# Altium schematic sheet USB.SchDoc
size 420 x 297 mm; SheetNumber: 12; SheetTotal: 21
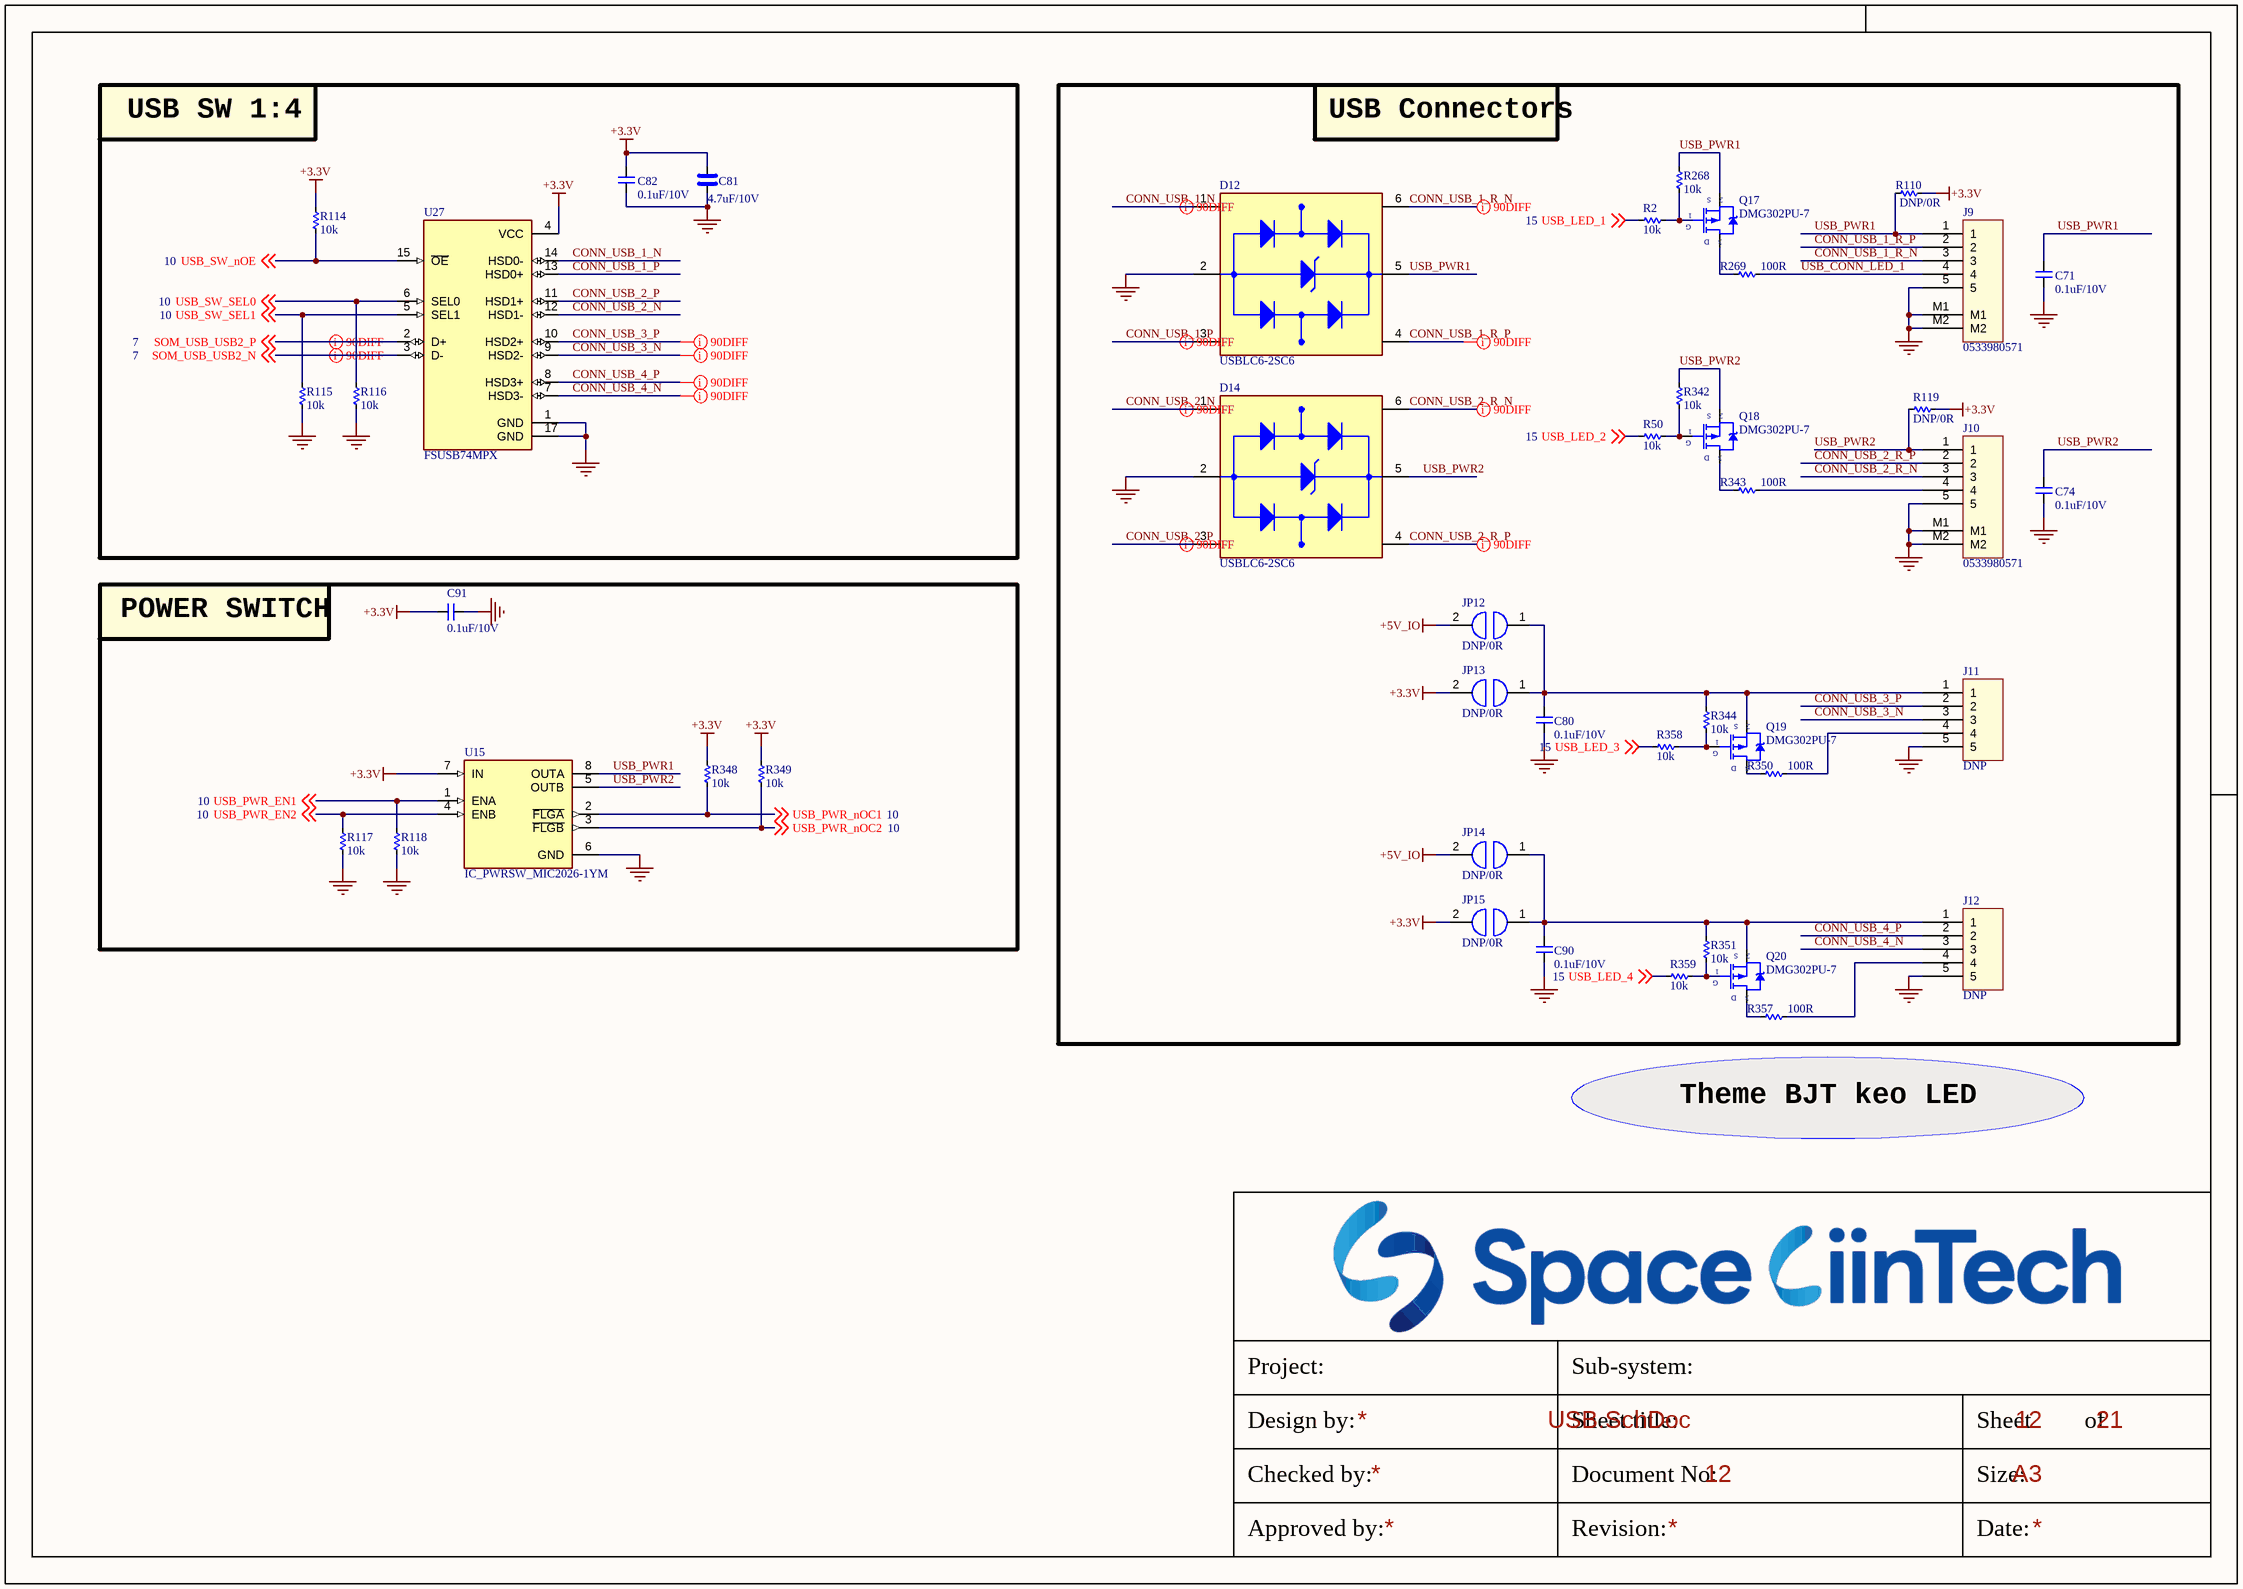
[diagram p0: USB.SchDoc]

## Parts
C71  0.1uF/10V  [CAP_C_1005X60]
C74  0.1uF/10V  [CAP_C_1005X60]
C80  0.1uF/10V  [CAP_C_1005X60]
C81  4.7uF/10V  [CAP_C_1608X80]
C82  0.1uF/10V  [CAP_C_1005X60]
C90  0.1uF/10V  [CAP_C_1005X60]
C91  0.1uF/10V  [CAP_C_1005X60]
D12  USBLC6-2SC6  [SOT95P280X145-6N]
D14  USBLC6-2SC6  [SOT95P280X145-6N]
J9  0533980571  [MOLEX_0533980571]
J10  0533980571  [MOLEX_0533980571]
J11  DNP  [SMD_5_PIN]
J12  DNP  [SMD_5_PIN]
JP12  DNP/0R  [RES_C_1608X60]
JP13  DNP/0R  [RES_C_1608X60]
JP14  DNP/0R  [RES_C_1608X60]
JP15  DNP/0R  [RES_C_1608X60]
Q17  DMG302PU-7  [SOT95P240X120-3N]
Q18  DMG302PU-7  [SOT95P240X120-3N]
Q19  DMG302PU-7  [SOT95P240X120-3N]
Q20  DMG302PU-7  [SOT95P240X120-3N]
R2  10k  [RES_C_1005X40]
R50  10k  [RES_C_1005X40]
R110  DNP/0R  [RES_C_1005X40]
R114  10k  [RES_C_1005X40]
R115  10k  [RES_C_1005X40]
R116  10k  [RES_C_1005X40]
R117  10k  [RES_C_1005X40]
R118  10k  [RES_C_1005X40]
R119  DNP/0R  [RES_C_1005X40]
R268  10k  [RES_C_1005X40]
R269  100R  [RES_C_1005X40]
R342  10k  [RES_C_1005X40]
R343  100R  [RES_C_1005X40]
R344  10k  [RES_C_1005X40]
R348  10k  [RES_C_1005X40]
R349  10k  [RES_C_1005X40]
R350  100R  [RES_C_1005X40]
R351  10k  [RES_C_1005X40]
R357  100R  [RES_C_1005X40]
R358  10k  [RES_C_1005X40]
R359  10k  [RES_C_1005X40]
U15  IC_PWRSW_MIC2026-1YM  [SOIC127P602X173-8N]
U27  FSUSB74MPX  [QFN50P300X300X80-17N]

## Blocks framed on the sheet
USB SW 1:4: C81 C82 R114-R116 U27
USB Connectors: C71 C74 C80 C90 D12 D14 J9-J12 JP12-JP15 Q17-Q20 R2 R50 R110 R119 R268 R269 R342-R344 R350 R351 R357-R359
POWER SWITCH: C91 R117 R118 R348 R349 U15

## Nets
+3.3V: C81.2 C82.2 C91.2 JP13.2 JP15.2 R110.1 R114.1 R119.1 R348.1 R349.1 U15.7(IN) U27.4(VCC)
+5V_IO: JP12.2 JP14.2
GND: C71.1 C74.1 C80.1 C81.1 C82.1 C90.1 C91.1 D12.2(GND) D14.2(GND) J9.5 J9.M1 J9.M2 J10.5 J10.M1 J10.M2 J11.5 J12.5 R115.2 R116.2 R117.2 R118.2 U15.6(GND) U27.1(GND) U27.17(GND)
CONN_USB_1_N: D12.1(I/O1_IN) U27.14(HSD0-)
CONN_USB_1_P: D12.3(I/O2_IN) U27.13(HSD0+)
CONN_USB_1_R_N: D12.6(I/O1_OUT) J9.3
CONN_USB_1_R_P: D12.4(I/O2_OUT) J9.2
CONN_USB_2_N: D14.1(I/O1_IN) U27.12(HSD1-)
CONN_USB_2_P: D14.3(I/O2_IN) U27.11(HSD1+)
CONN_USB_2_R_N: D14.6(I/O1_OUT) J10.3
CONN_USB_2_R_P: D14.4(I/O2_OUT) J10.2
CONN_USB_3_N: J11.3 U27.9(HSD2-)
CONN_USB_3_P: J11.2 U27.10(HSD2+)
CONN_USB_4_N: J12.3 U27.7(HSD3-)
CONN_USB_4_P: J12.2 U27.8(HSD3+)
SOM_USB_USB2_N: U27.3(D-) ; off-sheet SOM_USB_USB2_N
SOM_USB_USB2_P: U27.2(D+) ; off-sheet SOM_USB_USB2_P
USB_CONN_LED_1: J9.4 R269.2
USB_LED_1: R2.1 ; off-sheet USB_LED_1
USB_LED_2: R50.1 ; off-sheet USB_LED_2
USB_LED_3: R358.1 ; off-sheet USB_LED_3
USB_LED_4: R359.1 ; off-sheet USB_LED_4
USB_PWR1: C71.2 D12.5(VBUS) J9.1 Q17.2(S) R110.2 R268.1 U15.8(OUTA)
USB_PWR2: C74.2 D14.5(VBUS) J10.1 Q18.2(S) R119.2 R342.1 U15.5(OUTB)
USB_PWR_EN1: R118.1 U15.1(ENA) ; off-sheet USB_PWR_EN1
USB_PWR_EN2: R117.1 U15.4(ENB) ; off-sheet USB_PWR_EN2
USB_PWR_nOC1: R348.2 U15.2(~{FLGA}) ; off-sheet USB_PWR_nOC1
USB_PWR_nOC2: R349.2 U15.3(~{FLGB}) ; off-sheet USB_PWR_nOC2
USB_SW_nOE: R114.2 U27.15(~{OE}) ; off-sheet USB_SW_nOE
USB_SW_SEL0: R116.1 U27.6(SEL0) ; off-sheet USB_SW_SEL0
USB_SW_SEL1: R115.1 U27.5(SEL1) ; off-sheet USB_SW_SEL1
NetC80_2: C80.2 J11.1 JP12.1 JP13.1 Q19.2(S) R344.1
NetC90_2: C90.2 J12.1 JP14.1 JP15.1 Q20.2(S) R351.1
NetJ10_4: J10.4 R343.2
NetJ11_4: J11.4 R350.2
NetJ12_4: J12.4 R357.2
NetQ17_1: Q17.1(G) R2.2 R268.2
NetQ17_3: Q17.3(D) R269.1
NetQ18_1: Q18.1(G) R50.2 R342.2
NetQ18_3: Q18.3(D) R343.1
NetQ19_1: Q19.1(G) R344.2 R358.2
NetQ19_3: Q19.3(D) R350.1
NetQ20_1: Q20.1(G) R351.2 R359.2
NetQ20_3: Q20.3(D) R357.1

## Layout directives
differential pair; differential pair class DIFF90: CONN_USB_1_N, CONN_USB_1_P, CONN_USB_1_R_N, CONN_USB_1_R_P, CONN_USB_2_N, CONN_USB_2_P, CONN_USB_2_R_N, CONN_USB_2_R_P, CONN_USB_3_N, CONN_USB_3_P, CONN_USB_4_N, CONN_USB_4_P, SOM_USB_USB2_N, SOM_USB_USB2_P

## Notes on the sheet
- Theme BJT keo LED
- Project:
- Sub-system:
- Design by:
- Sheet title:
- Sheet
- of
- Checked by:
- Approved by:
- Revision:
- Document No:
- Size:
- Date:
- A3

## Library data of the parts
C71 C74 C80 C82 C90 C91 = _CAP_C_2: CAP CHIP
C81 = _CAP_C_High_2: CAP CHIP High Value
D12 D14 = USBLC6-2SC6: 17V Clamp 5A (8/20Âµs) Ipp Tvs Diode Surface Mount SOT-23-6; MF: STMicroelectronics; Value: *; SnapEDA_Link: https://www.snapeda.com/parts/USBLC6-2SC6/STMicroelectronics/view-part/?ref=snap; Check_prices: https://www.snapeda.com/parts/USBLC6-2SC6/STMicroelectronics/view-part/?ref=eda; Purchase-URL: https://pricing.snapeda.com/search/part/USBLC6-2SC6/?ref=eda; Price: None; Availability: In Stock; Package: SOT-23-6 STMicroelectronics; MP: USBLC6-2SC6
J9 J10 = Header 5x1_2M
J11 J12 = Header 5x1
JP12-JP15 = JUMPER
Q17-Q20 = MOSFET_P_GSD
R2 R50 R110 R114-R119 R268 R269 R342-R344 R348-R351 R357-R359 = _RES_B_2: RES
U15 = IC_PWRSW_MIC2026-1YM: Power Switch/Driver 1:2 N-Channel 1.25A 8-SOIC; MF: Microchip; SnapEDA_Link: https://www.snapeda.com/parts/MIC2026-1YM/Microchip/view-part/?ref=snap; Package: SO-8 Microchip; Value: *; MP: MIC2026-1YM; Check_prices: https://www.snapeda.com/parts/MIC2026-1YM/Microchip/view-part/?ref=eda
U27 = IC_USB_SW_FSUSB74MPX: USB Switch IC 1 Channel 16-MLP (3x3); MF: ON Semiconductor; SnapEDA_Link: https://www.snapeda.com/parts/FSUSB74MPX/Onsemi/view-part/?ref=snap; Package: WQFN-16 ON Semiconductor; Value: *; MP: FSUSB74MPX; Check_prices: https://www.snapeda.com/parts/FSUSB74MPX/Onsemi/view-part/?ref=eda